# Altium project BeagleBoneExt.PrjPcb
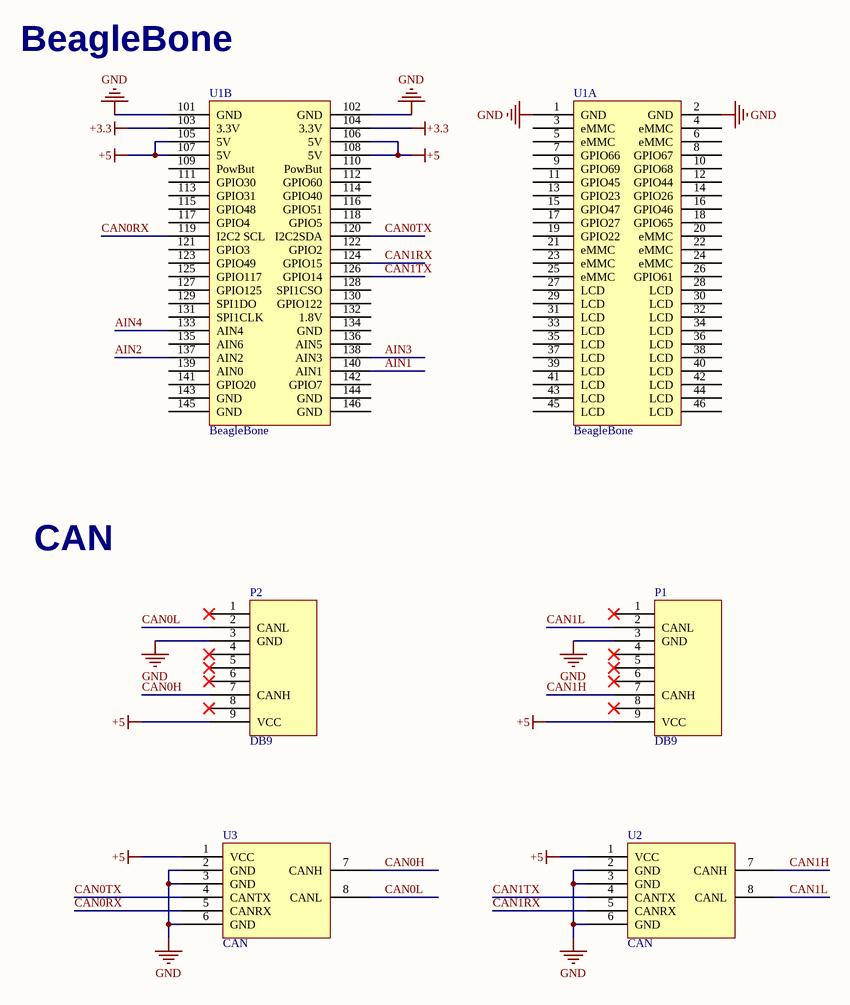
[diagram p0: BBBExtend.SchDoc]
1 sheet, 5 parts. Net scope: global (net labels, ports and power ports of the same name join across sheets).
Board files: S32K144CoreBoard_Dock.PcbDoc, BBBExtend.PcbDoc

## Sheet BBBExtend.SchDoc
size A3

### Parts
P1  DB9  [DB9]
P2  DB9  [DB9]
U1  BeagleBone  [BeagleBoneB]  (parts A,B of 2)
U2  CAN  [CANTRer]
U3  CAN  [CANTRer]

### Nets
+3.3: U1.103(3.3V) U1.104(3.3V)
+5: P1.9(VCC) P2.9(VCC) U1.105(5V) U1.106(5V) U1.107(5V) U1.108(5V) U2.1(VCC) U3.1(VCC)
GND: P1.3(GND) P2.3(GND) U1.1(GND) U1.2(GND) U1.101(GND) U1.102(GND) U2.2(GND) U2.3(GND) U2.6(GND) U3.2(GND) U3.3(GND) U3.6(GND)
AIN1: U1.140(AIN1)
AIN2: U1.137(AIN2)
AIN3: U1.138(AIN3)
AIN4: U1.133(AIN4)
CAN0H: P2.7(CANH) U3.7(CANH)
CAN0L: P2.2(CANL) U3.8(CANL)
CAN0RX: U1.119(I2C2_SCL) U3.5(CANRX)
CAN0TX: U1.120(I2C2SDA) U3.4(CANTX)
CAN1H: P1.7(CANH) U2.7(CANH)
CAN1L: P1.2(CANL) U2.8(CANL)
CAN1RX: U1.124(GPIO15) U2.5(CANRX)
CAN1TX: U1.126(GPIO14) U2.4(CANTX)

Not connected (* = marked no-connect by the designer): P1 1* 4* 5* 6* 8*; P2 1* 4* 5* 6* 8*; U1 3(eMMC) 4(eMMC) 5(eMMC) 6(eMMC) 7(GPIO66) 8(GPIO67) 9(GPIO69) 10(GPIO68) 11(GPIO45) 12(GPIO44) 13(GPIO23) 14(GPIO26) 15(GPIO47) 16(GPIO46) 17(GPIO27) 18(GPIO65) 19(GPIO22) 20(eMMC) 21(eMMC) 22(eMMC) 23(eMMC) 24(eMMC) 25(eMMC) 26(GPIO61) 27(LCD) 28(LCD) 29(LCD) 30(LCD) 31(LCD) 32(LCD) 33(LCD) 34(LCD) 35(LCD) 36(LCD) 37(LCD) 38(LCD) 39(LCD) 40(LCD) 41(LCD) 42(LCD) 43(LCD) 44(LCD) 45(LCD) 46(LCD) 109(PowBut) 110(PowBut) 111(GPIO30) 112(GPIO60) 113(GPIO31) 114(GPIO40) 115(GPIO48) 116(GPIO51) 117(GPIO4) 118(GPIO5) 121(GPIO3) 122(GPIO2) 123(GPIO49) 125(GPIO117) 127(GPIO125) 128(SPI1CSO) 129(SPI1DO) 130(GPIO122) 131(SPI1CLK) 132(1.8V) 134(GND) 135(AIN6) 136(AIN5) 139(AIN0) 141(GPIO20) 142(GPIO7) 143(GND) 144(GND) 145(GND) 146(GND)

### Notes on the sheet
- BeagleBone
- CAN